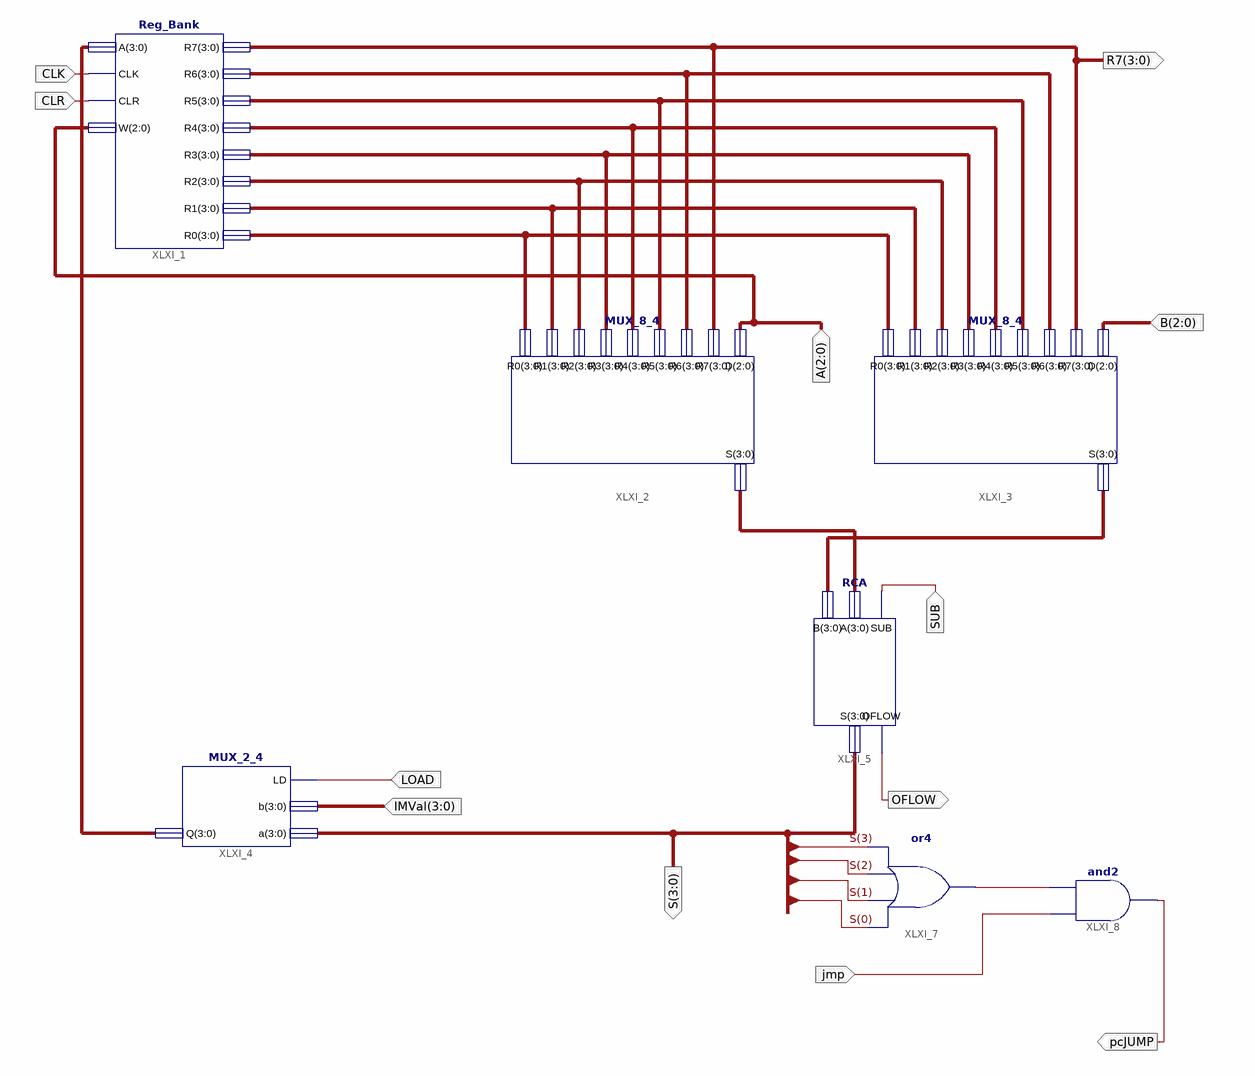
[diagram p0: schematic sheet 1]
// Xilinx ISE schematic ALUnReg.sch (spartan3e) as structural Verilog: 7 symbols, 12 ports
module ALUnReg (
  input  [3:0] IMVal,
  input  LOAD,
  input  SUB,
  input  CLK,
  input  CLR,
  input  [2:0] A,
  input  [2:0] B,
  input  jmp,
  output [3:0] R7,
  output [3:0] S,
  output OFLOW,
  output pcJUMP
);

  wire XLXN_44;
  wire [3:0] XLXN_1, XLXN_11, XLXN_12, XLXN_13, XLXN_14, XLXN_15, XLXN_16, XLXN_17, XLXN_19, XLXN_20;

  Reg_Bank XLXI_1 (
    .A(XLXN_1), .CLK(CLK), .CLR(CLR), .R0(XLXN_17), .R1(XLXN_16), .R2(XLXN_15), .R3(XLXN_14), .R4(XLXN_13),
    .R5(XLXN_12), .R6(XLXN_11), .R7(R7), .W(A));
  MUX_8_4 XLXI_2 (
    .D(A), .R0(XLXN_17), .R1(XLXN_16), .R2(XLXN_15), .R3(XLXN_14), .R4(XLXN_13), .R5(XLXN_12), .R6(XLXN_11),
    .R7(R7), .S(XLXN_20));
  MUX_8_4 XLXI_3 (
    .D(B), .R0(XLXN_17), .R1(XLXN_16), .R2(XLXN_15), .R3(XLXN_14), .R4(XLXN_13), .R5(XLXN_12), .R6(XLXN_11),
    .R7(R7), .S(XLXN_19));
  MUX_2_4 XLXI_4 (.a(S), .b(IMVal), .LD(LOAD), .Q(XLXN_1));
  RCA XLXI_5 (.A(XLXN_20), .B(XLXN_19), .OFLOW(OFLOW), .S(S), .SUB(SUB));
  or XLXI_7 (XLXN_44, S[0], S[1], S[2], S[3]);
  and XLXI_8 (pcJUMP, jmp, XLXN_44);
endmodule
